# Altium schematic sheet SWD.SchDoc
size A4
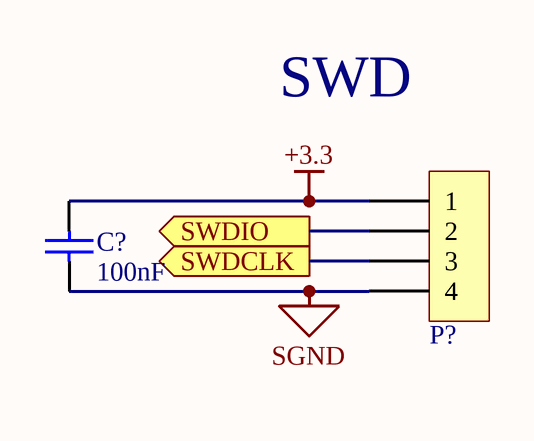
[diagram p0: SWD.SchDoc]

## Parts
C?  value 100nF  [0603]  (hidden comment: Cap)
P?  Header 4  [HDR4X1_A]  (value not drawn)

## Ports
SWDCLK (out), SWDIO (out)

## Nets
+3.3: C?.2 P?.1
SGND: C?.1 P?.4
SWDCLK: P?.3 ; port SWDCLK
SWDIO: P?.2 ; port SWDIO

## Notes on the sheet
- (near P?) SWD

## Library data of the parts
C? = Cap: 无极性电容; Published: 8-Jun-2000; LatestRevisionDate: 17-Jul-2002; LatestRevisionNote: Re-released for DXP Platform.; PackageReference: RAD-0.3; Publisher: Altium Limited
P? = Header 4: 接插件; LatestRevisionDate: 17-Jul-2002; LatestRevisionNote: Re-released for DXP Platform.; Publisher: Altium Limited